# Altium schematic sheet RP2350_Power.SchDoc: Power and USB
size Letter; Organization: NewAE Technology Inc.; Address1: 1083 Queen St., Suite 196; Address2: Halifax; Address3: NS; Address4: Canada B3H 0B2; DocumentNumber: .; Revision: .; SheetNumber: 3; SheetTotal: 4; SheetApproved: NO
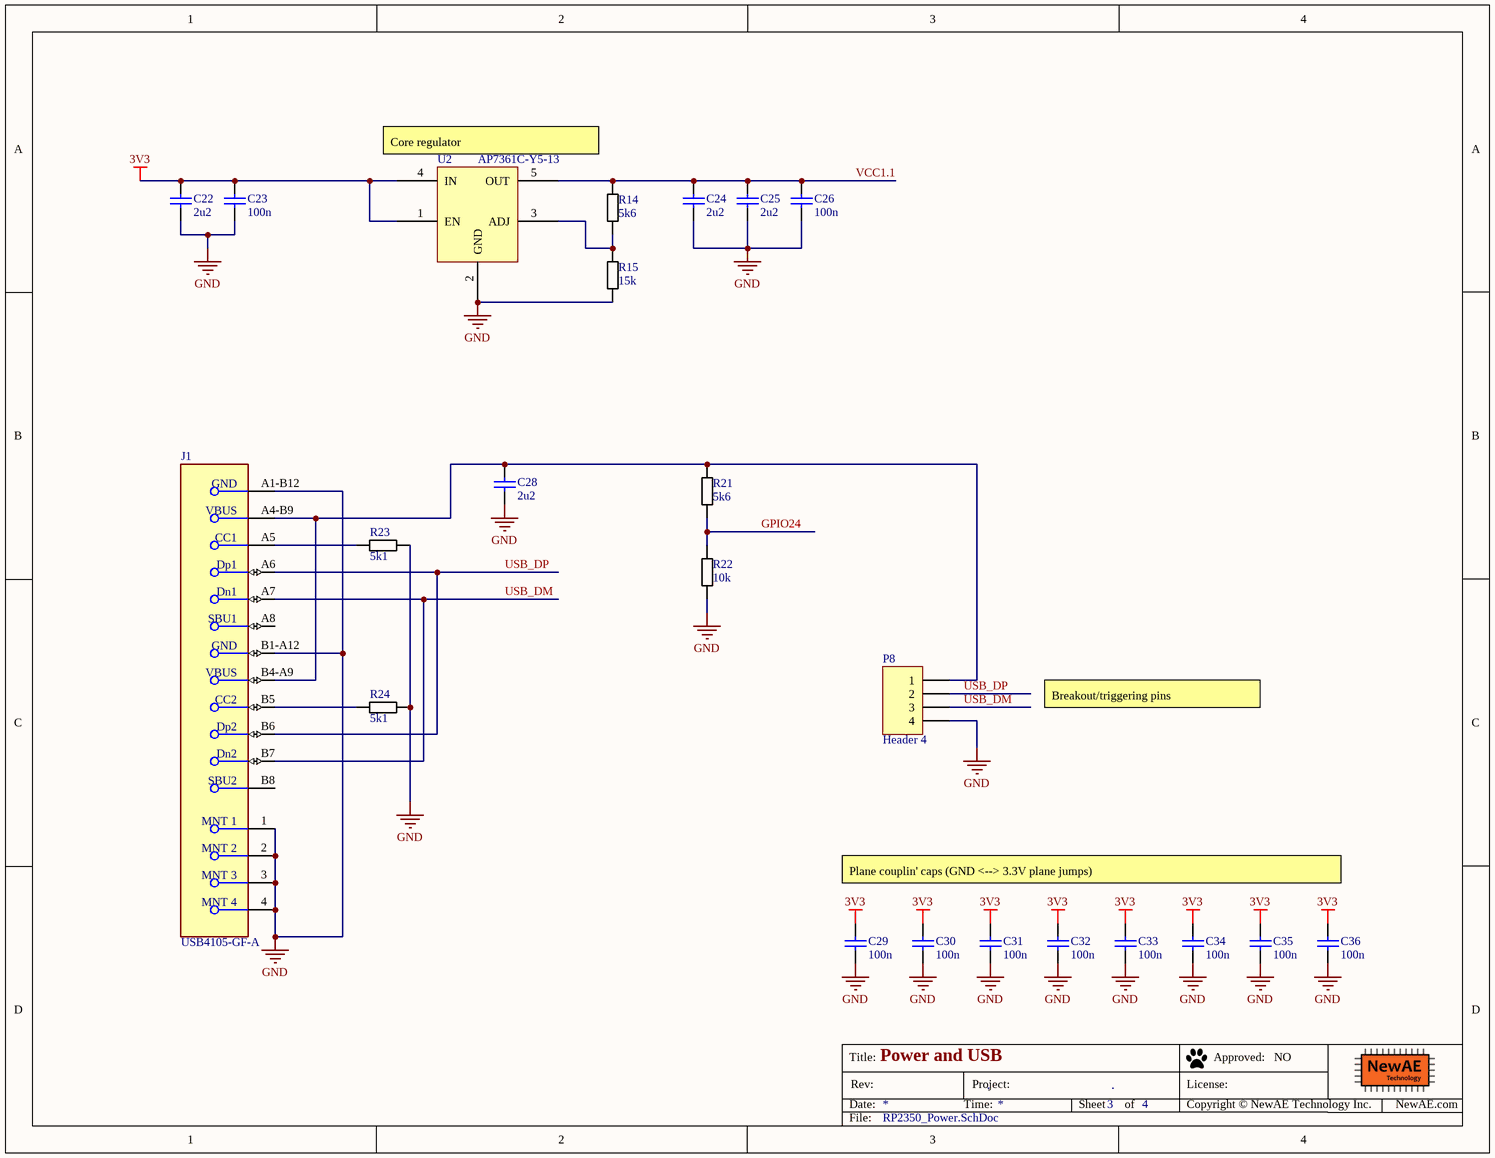
[diagram p0: RP2350_Power.SchDoc]

## Parts
C22  2u2  [CAPC0603_M]
C23  100n  [CAPC0402_M]
C24  2u2  [CAPC0603_M]
C25  2u2  [CAPC0603_M]
C26  100n  [CAPC0402_M]
C28  2u2  [CAPC0603_M]
C29  100n  [CAPC0402_M]
C30  100n  [CAPC0402_M]
C31  100n  [CAPC0402_M]
C32  100n  [CAPC0402_M]
C33  100n  [CAPC0402_M]
C34  100n  [CAPC0402_M]
C35  100n  [CAPC0402_M]
C36  100n  [CAPC0402_M]
J1  USB4105-GF-A  [FP-USB4105-GF-A-MFG]
P8  Header 4  [HDR1X4]
R14  5k6  [RESC1608X55N]
R15  15k  [RESC1608X55N]
R21  5k6  [RESC1608X55N]
R22  10k  [RESC1608X55N]
R23  5k1  [RESC1608X55N]
R24  5k1  [RESC1608X55N]
U2  AP7361C-Y5-13  [SOT89-5]

## Nets
3V3: C22.1 C23.1 C29.1 C30.1 C31.1 C32.1 C33.1 C34.1 C35.1 C36.1 U2.1(EN) U2.4(IN)
GND: C22.2 C23.2 C24.2 C25.2 C26.2 C28.2 C29.2 C30.2 C31.2 C32.2 C33.2 C34.2 C35.2 C36.2 J1.1(MNT_1) J1.2(MNT_2) J1.3(MNT_3) J1.4(MNT_4) J1.A1-B12(GND) J1.B1-A12(GND) P8.4 R15.2 R22.2 R23.2 R24.2 U2.2(GND)
GPIO24: R21.2 R22.1
USB_DM: J1.A7(Dn1) J1.B7(Dn2) P8.3
USB_DP: J1.A6(Dp1) J1.B6(Dp2) P8.2
VCC1.1: C24.1 C25.1 C26.1 R14.1 U2.5(OUT)
NetC28_1: C28.1 J1.A4-B9(VBUS) J1.B4-A9(VBUS) P8.1 R21.1
NetJ1_A5: J1.A5(CC1) R23.1
NetJ1_B5: J1.B5(CC2) R24.1
NetR14_2: R14.2 R15.1 U2.3(ADJ)

Not connected (* = marked no-connect by the designer): J1 A8(SBU1) B8(SBU2)

## Notes on the sheet
- Core regulator
- Breakout/triggering pins
- Plane couplin' caps (GND <--> 3.3V plane jumps)
- Title:
- Date:
- Rev:
- Time:
- Project:
- Sheet
- of
- License:
- Copyright © NewAE Technology Inc.
- Approved:
- NewAE.com
- File:

## Library data of the parts
C22 C24 C25 C28 = CCHIP-2u2-0603: 2u2, 0603; Manufacture 1: Samsung; Manufacture Part Number 1: CL10B225KP8NNNC; Component Group: Capacitor; Case-EIA: 0603; Case-Metric: 1608; Rated Voltage: 10VDC; Part Number: CCHIP-2u2-0603; Footprint: 0603; Pin Count: 2; Supplier 1: Digi-Key; Supplier Part Number 1: 1276-1134-1-ND; Value: 2u2; Mounting Technology: SMT; Component Kind: Standard; Component Type: Standard
C23 C26 C29-C36 = CCHIP-100n-0402: 100n, 0402; Manufacture Part Number 1: CGA2B3X7R1V104K050BB; Component Group: Capacitor; Case-EIA: 0402; Part Number: CCHIP-100n-0402; Footprint: 0402; Pin Count: 2; Supplier 1: Digi-Key; Supplier Part Number 1: 445-6901-1-ND; Value: 100n; Mounting Technology: SMT; Component Kind: Standard; Component Type: Standard
J1 = CMP-245163-000001-1: CONN RCPT USB2.0 TYPEC 5A; Manufacturer: GCT; Voltage Rating: 20V; Is Female: yes; Current Rating: 5/6.25/1.25/0.25A; Number Of Contacts: 16; Conn Orientation: Right Angle; Device Class L1: Connectors; Category: Conn; Lead Free: Yes; RoHS: TRUE; Temperature Range High: +85°C; Digikey Description: CONN RCPT USB2.0 TYPEC 5A; Device Class L3: unset; ComponentLink2Description: Datasheet; Manufacturer Part Number: USB4105-GF-A; Package: 0; Usb Standard: USB 2.0; Device Class L2: USB Connectors; Automotive: No; Temperature Range Low: -40°C; Height: 3.46mm; Temperature: -40°C to +85°C; Contact Material: Gold,Nickel; ComponentLink2URL: https://gct.co/files/drawings/usb4105.pdf; Octopart: https://octopart.com/usb4105-gf-a-gct-106627878
P8 = Header 4: Header, 4-Pin; LatestRevisionDate: 17-Jul-2002; LatestRevisionNote: Re-released for DXP Platform.; Publisher: Altium Limited
R14 R21 = RCHIP-5K6-0603: 5k6 res, 0603, 1%, 1/10W; Manufacture 1: Yageo; Manufacture Part Number 1: RC0603FR-075K6L; Component Group: Resistor; Case-EIA: 0603; Case-Metric: 1608; Rated Power: 0.1W; Rated Voltage: 75VDC; Part Number: RCHIP-5K6-0603; Footprint: 0603; Pin Count: 2; Mounting Technology: SMT; Component Kind: Standard; Component Type: Standard; Supplier 1: Digi-Key; Supplier Part Number 1: 311-5.60KHRCT-ND; Value: 5k6; Tolerance: 1%; Temperature Range: -55C to 155C
R15 = RCHIP-15k-0603: 15k res, 0603, 1%, 1/10W; Manufacture 1: Yageo; Manufacture Part Number 1: RC0603FR-0715KL; Component Group: Resistor; Case-EIA: 0603; Case-Metric: 1608; Rated Power: 0.1W; Rated Voltage: 75VDC; Part Number: RCHIP-15K-0603; Footprint: 0603; Pin Count: 2; Mounting Technology: SMT; Component Kind: Standard; Component Type: Standard; Supplier 1: Digi-Key; Supplier Part Number 1: 311-15.0KHRCT-ND; Value: 15k; Tolerance: 1%; Temperature Range: -55C to 155C
R22 = RCHIP-10K-0603: 10k res, 0603, 1%, 1/10W; Manufacture 1: Yageo; Manufacture Part Number 1: RC0603FR-0710KL; Component Group: Resistor; Case-EIA: 0603; Case-Metric: 1608; Rated Power: 0.1W; Rated Voltage: 75VDC; Part Number: RCHIP-10K-0603; Footprint: 0603; Pin Count: 2; Supplier 1: Digi-Key; Supplier Part Number 1: 311-10.0KHRCT-ND; Value: 10k; Tolerance: 1%; Mounting Technology: SMT; Temperature Range: -55C to 155C; Component Kind: Standard; Component Type: Standard
R23 R24 = RCHIP-5K1-0603: 5k1 res, 0603, 1%, 1/10W; Manufacture 1: Yageo; Manufacture Part Number 1: RC0603FR-075K1L; Component Group: Resistor; Case-EIA: 0603; Case-Metric: 1608; Rated Power: 0.1W; Rated Voltage: 75VDC; Part Number: RCHIP-5K1-0603; Footprint: 0603; Pin Count: 2; Supplier 1: Digi-Key; Supplier Part Number 1: 311-5.10KHRCT-ND; Value: 5k1; Tolerance: 1%; Mounting Technology: SMT; Temperature Range: -55C to 155C; Component Kind: Standard; Component Type: Standard
U2 = AP7361C-Y5-13: Regulator, Adj, LDO, 1A; Manufacture 1: Diodes Inc; Component Group: Analog IC; PP Material Stack: 0; Part Number: AP7361C-Y5-13; Manufacture Part Number 1: AP7361C-Y5-13; Pin Count: 5; Supplier 1: Digi-Key; Supplier Part Number 1: AP7361C-Y5-13DICT-ND; Component Kind: Standard; Component Type: Standard; PP Rotation: 0; PP Rotation1: 0